# EAGLE schematic head_board (EAGLE 7.3.0)
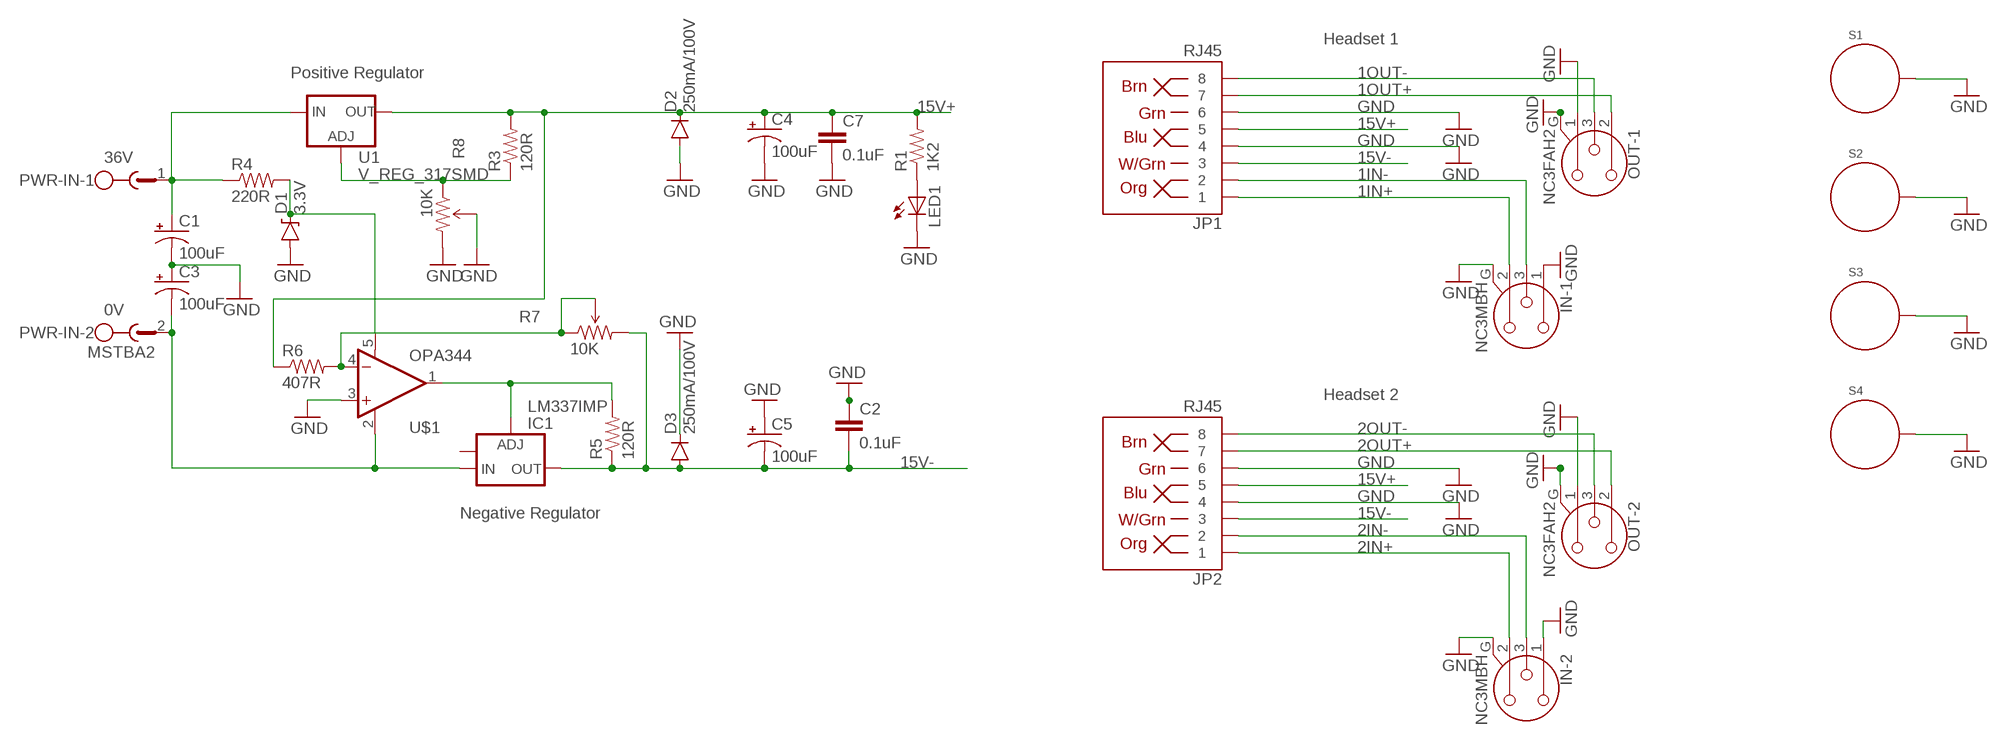
[diagram p0: schematic, sheet 1]

## Parts
C1  100uF  CAP_POLPTH1  [CPOL-RADIAL-100UF-25V]
C2  0.1uF  0.1UF-25V-5%(0603)  [0603-CAP]
C3  100uF  CAP_POLPTH1  [CPOL-RADIAL-100UF-25V]
C4  100uF  CAP_POLPTH1  [CPOL-RADIAL-100UF-25V]
C5  100uF  CAP_POLPTH1  [CPOL-RADIAL-100UF-25V]
C7  0.1uF  0.1UF-25V-5%(0603)  [0603-CAP]
D1  3.3V  DIODE-ZENER3.3V  [SOD-323]
D2  250mA/100V  DIODEBAS16  [SOD-323]
D3  250mA/100V  DIODEBAS16  [SOD-323]
IC1  LM337IMP  [SOT-223]
IN-1  NC3MBH  [NC3MBH]
IN-2  NC3MBH  [NC3MBH]
JP1  RJ45  RJ45-8PTH  [RJ45-8]
JP2  RJ45  RJ45-8PTH  [RJ45-8]
LED1  LEDCHIPLED_0805  [CHIPLED_0805]
OUT-1  NC3FAH2  [NC3FAH2]
OUT-2  NC3FAH2  [NC3FAH2]
PWR-IN  MSTBA2  [MSTBA2]
R1  1K2  RESISTOR0603-RES  [0603-RES]
R3  120R  RESISTOR0603-RES  [0603-RES]
R4  220R  RESISTOR0603-RES  [0603-RES]
R5  120R  RESISTOR0603-RES  [0603-RES]
R6  407R  RESISTOR0603-RES  [0603-RES]
R7  10K  TRIMPOT-2  [TRIMPOT_TC33]
R8  10K  TRIMPOT-2  [TRIMPOT_TC33]
S1  STANDOFF_ELECTRICAL  [STANDOFF-ELECTRICAL]
S2  STANDOFF_ELECTRICAL  [STANDOFF-ELECTRICAL]
S3  STANDOFF_ELECTRICAL  [STANDOFF-ELECTRICAL]
S4  STANDOFF_ELECTRICAL  [STANDOFF-ELECTRICAL]
U1  V_REG_317SMD  [SOT223]
U$1  OPA344  [SOT23-5]

## Nets
1IN+: IN-1.2 JP1.1
1IN-: IN-1.3 JP1.2
1OUT+: JP1.7 OUT-1.2
1OUT-: JP1.8 OUT-1.3
2IN+: IN-2.2 JP2.1
2IN-: IN-2.3 JP2.2
2OUT+: JP2.7 OUT-2.2
2OUT-: JP2.8 OUT-2.3
15V+: C4.1(+) C7.1 D2.C JP1.5 JP2.5 R1.2 R3.2 R6.1 U1.2(OUT)
15V-: C2.2 C5.2(-) D3.A IC1.3(OUT) JP1.3 JP2.3 R5.1 R7.3(CW)
GND: C1.2(-) C2.1 C3.1(+) C4.2(-) C5.1(+) C7.2 D1.A D2.A D3.C IN-1.1 IN-1.G IN-2.1 IN-2.G JP1.4 JP1.6 JP2.4 JP2.6 LED1.C OUT-1.1 OUT-1.G OUT-2.1 OUT-2.G R8.2(WIPER) R8.3(CW) S1.P1 S2.P1 S3.P1 S4.P1 U$1.3(+IN)
N$1: C1.1(+) PWR-IN.1 R4.1 U1.3(IN)
N$2: R6.2 R7.1(CCW) R7.2(WIPER) U$1.4(-IN)
N$3: LED1.A R1.1
N$4: R3.1 R8.1(CCW) U1.1(ADJ)
N$7: IC1.1(ADJ) R5.2 U$1.1(OUT)
N$8: C3.2(-) IC1.2(IN) PWR-IN.2 U$1.2(V-)
N$9: D1.C R4.2 U$1.5(V+)
Unconnected: IC1.4

## Notes on the sheet
- Headset 1
- Positive Regulator
- 36V
- 0V
- Headset 2
- Negative Regulator

## Library data of the parts
C1 C3-C5 = SparkFun-Passives:CAP_POL: Capacitor Polarized These are standard SMD and PTH capacitors. Normally 10uF, 47uF, and 100uF in electrolytic and tantalum varieties. Always verify the external diameter of the through hole cap, it varies with capacity, voltage, and manufacturer. The EIA devices should be standard.
C2 C7 = SparkFun-Capacitors:0.1UF-25V-5%(0603): CAP-08604; PROD_ID: CAP-08604
D1 = SparkFun-DiscreteSemi:DIODE-ZENER: Zener Diode Production Part - 8199 3.4V Zener Voltage; PROD_ID: DIO-11284
D2 D3 = SparkFun-DiscreteSemi:DIODE: Diode These are standard reverse protection diodes and small signal diodes. SMA package can handle up to about 1A. SOD-323 can handle about 200mA. What the SOD-323 package when ordering, there are some mfgs out there that are 5-pin packages.; PROD_ID: DIO-09646
IC1 = AWJLEagleLib:LM337: LM337 adjustable negative voltage regulator
IN-1 IN-2 = con-neutrik_ag:NC3: Neutrik Audio Connector XLR SERIES Stereo 1/4" jack Source: www.neutrik.com/; MF: NEUTRIK; MPN: NC3MBH; OC_FARNELL: unknown; OC_NEWARK: 91F3470
JP1 JP2 = SparkFun-Connectors:RJ45-8: RJ45 Jack Simple RJ45, 8-pin connection - connector for common Cat5, Cat5e, and Cat6 Ethernet cables. Footprint not yet proven in production. Connector sku is PRT-00643; Breakout PCB sku is BOB-00716.; PROD_ID: CONN-08506
LED1 = adafruit:LED: LED OSRAM: - CHIPLED LG R971, LG N971, LY N971, LG Q971, LY Q971, LO R971, LY R971 LH N974, LH R974 LS Q976, LO Q976, LY Q976 LO Q996 - Hyper CHIPLED LW Q18S LB Q993, LB Q99A, LB R99A - SideLED LS A670, LO A670, LY A670, LG A670, LP A670 LB A673, LV A673, LT A673, LW A673 LH A674 LY A675 LS A676, LA A676, LO A676, LY A676, LW A676 LS A679, LY A679, LG A679 - Hyper Micro SIDELED® LS Y876, LA Y876, LO Y876, LY Y876 LT Y87S - SmartLED LW L88C, LW L88S LB L89C, LB L89S, LG L890 LS L89K, LO L89K, LY L89K LS L896, LA L896, LO L896, LY L896 - TOPLED LS T670, LO T670, LY T670, LG T670, LP T670 LSG T670, LSP T670, LSY T670, LOP T670, LYG T670 LG T671, LOG T671, LSG T671 LB T673, LV T673, LT T673, LW T673 LH T674 LS T676, LA T676, LO T676, LY T676, LB T676, LH T676, LSB T676, LW T676 LB T67C, LV T67C, LT T67C, LS T67K, LO T67K, LY T67K, LW E67C LS E67B, LA E67B, LO E67B, LY E67B, LB E67C, LV E67C, LT E67C LW T67C LS T679, LY T679, LG T679 LS T770, LO T770, LY T770, LG T770, LP T770 LB T773, LV T773, LT T773, LW T773 LH T774 LS E675, LA E675, LY E675, LS T675 LS T776, LA T776, LO T776, LY T776, LB T776 LHGB T686 LT T68C, LB T68C - Hyper Mini TOPLED® LB M676 - Mini TOPLED Santana® LG M470 LS M47K, LO M47K, LY M47K Source: http://www.osram.convergy.de/
OUT-1 OUT-2 = con-neutrik_ag:NC3: Neutrik Audio Connector XLR SERIES Stereo 1/4" jack Source: www.neutrik.com/; MPN: NC3FAH2; OC_FARNELL: unknown; OC_NEWARK: 27B4208
PWR-IN = con-phoenix-508:MSTBA2: PHOENIX; MF: FARNELL; MPN: 1757242; OC_FARNELL: 3705171; OC_NEWARK: 71C4161
R1 R3-R6 = SparkFun-Passives:RESISTOR: Resistor Basic schematic elements and footprints for 0603, 1206, and PTH resistors.
R7 R8 = SparkFun-Electromechanical:TRIMPOT: Various small potentiometers for "set-and-forget" applications
S1-S4 = SparkFun-Electromechanical:STANDOFF_ELECTRICAL: A standoff intended to be an electrically connected point. Pad size and stop size allow for a #4 Phillips pan screw head to make a solid connection to the board.
U1 = SparkFun-PowerIC:V_REG_317: Voltage Regulator Standard LM317 adjustable voltage regulator. AOI (Adjust Output Input). Google 'LM317 Calculator' for easy to use app to get the two resistor values needed. 240/720 for 5V output. 240/390 for 3.3V output. Spark Fun Electronics SKU : COM-00527
U$1 = SparkFun-AnalogIC:OPA344: Single gate rail-to-rail output op-amp. Inputs extend 300mV past rails.; PROD_ID: IC-08251